# Altium schematic sheet main.SchDoc: Shield MCXC444
size A4; Author: Agustin Zuliani; CompanyName: Depto. de Sistemas e Informática (DSI); DrawnBy: Agustin Zuliani; Revision: Rev: 00; SheetNumber: 1; SheetTotal: 7
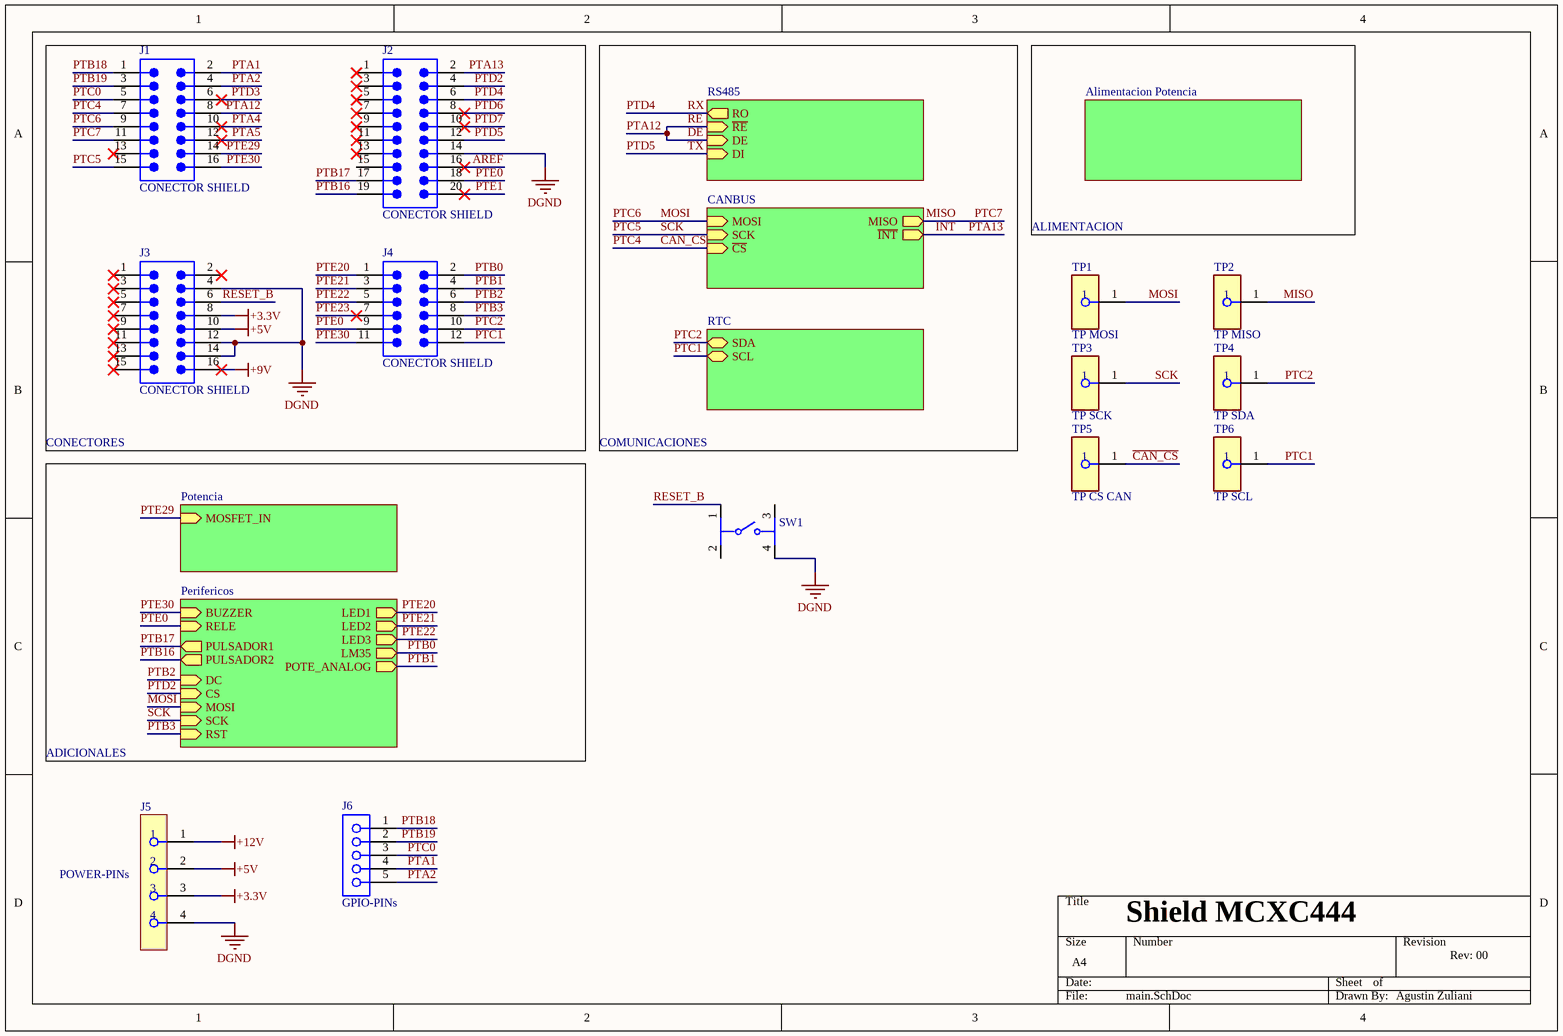
[diagram p0: main.SchDoc]

## Parts
J1  CONECTOR SHIELD  [61301621121]
J2  CONECTOR SHIELD  [61302021121]
J3  CONECTOR SHIELD  [61301621121]
J4  CONECTOR SHIELD  [61301221121]
J5  POWER-PINs  [FP-ESW-104-23-G-S-MFG]
J6  GPIO-PINs  [SMTC-SMH-105-02-X-S]
SW1  PULSADOR RESET  [FP-1-1825910-4-MFG]  (value not drawn)
TP1  TP MOSI  [FP-5004-MFG]
TP2  TP MISO  [FP-5004-MFG]
TP3  TP SCK  [FP-5004-MFG]
TP4  TP SDA  [FP-5004-MFG]
TP5  TP CS CAN  [FP-5004-MFG]
TP6  TP SCL  [FP-5004-MFG]

## Blocks framed on the sheet
CONECTORES: J1-J4

## Sub-sheets
Alimentacion Potencia = Alimentacion Potencia.SchDoc: no entries
CANBUS = CANBUS.SchDoc: MOSI (in), MISO (out), SCK (in), ~{CS} (in), ~{INT} (out)
Perifericos = Perifericos.SchDoc: LED1 (out), LED2 (out), LED3 (out), BUZZER (in), RELE (in), PULSADOR1 (out), PULSADOR2 (out), LM35 (out), POTE_ANALOG (out), DC (in), CS (in), MOSI (in), SCK (in), RST (in)
Potencia = Potencia.SchDoc: MOSFET_IN (in)
RS485 = RS485.SchDoc: ~{RE} (in), DE (in), DI (in), RO (out)
RTC = RTC.SchDoc: SDA (bidir), SCL (bidir)

## Nets
+3.3V: J3.8 J5.3
+5V: J3.10 J5.2
+9V: J3.16
+12V: J5.1
DGND: J2.14 J3.4 J3.12 J3.14 J5.4 SW1.4
~{CAN_CS}: J1.7 TP5.1 ; sheet CANBUS/~{CS}  [also labelled PTC4]
~{INT}: J2.2 ; sheet CANBUS/~{INT}  [also labelled PTA13]
~{RE}: J1.8 ; sheet RS485/~{RE}, sheet RS485/DE  [also labelled DE, PTA12]
AREF: J2.16
MISO: J1.11 TP2.1 ; sheet CANBUS/MISO  [also labelled PTC7]
MOSI: J1.9 TP1.1 ; sheet CANBUS/MOSI, sheet Perifericos/MOSI  [also labelled PTC6]
PTA1: J1.2 J6.4
PTA2: J1.4 J6.5
PTA4: J1.10
PTA5: J1.12
PTB0: J4.2 ; sheet Perifericos/LM35
PTB1: J4.4 ; sheet Perifericos/POTE_ANALOG
PTB2: J4.6 ; sheet Perifericos/DC
PTB3: J4.8 ; sheet Perifericos/RST
PTB16: J2.19 ; sheet Perifericos/PULSADOR2
PTB17: J2.17 ; sheet Perifericos/PULSADOR1
PTB18: J1.1 J6.1
PTB19: J1.3 J6.2
PTC0: J1.5 J6.3
PTC1: J4.12 TP6.1 ; sheet RTC/SCL
PTC2: J4.10 TP4.1 ; sheet RTC/SDA
PTC5: J1.15 TP3.1 ; sheet CANBUS/SCK, sheet Perifericos/SCK  [also labelled SCK]
PTD2: J2.4 ; sheet Perifericos/CS
PTD3: J1.6
PTD4: J2.6 ; sheet RS485/RO  [also labelled RX]
PTD5: J2.12 ; sheet RS485/DI  [also labelled TX]
PTD6: J2.8
PTD7: J2.10
PTE0: J2.18 J4.9 ; sheet Perifericos/RELE
PTE1: J2.20
PTE20: J4.1 ; sheet Perifericos/LED1
PTE21: J4.3 ; sheet Perifericos/LED2
PTE22: J4.5 ; sheet Perifericos/LED3
PTE23: J4.7
PTE29: J1.14 ; sheet Potencia/MOSFET_IN
PTE30: J1.16 J4.11 ; sheet Perifericos/BUZZER
RESET_B: J3.6 SW1.1

Not connected (* = marked no-connect by the designer): J1 13*; J2 1* 3* 5* 7* 9* 11* 13* 15; J3 1* 2* 3* 5* 7* 9* 11* 13* 15*; SW1 2 3

## Notes on the sheet
- ALIMENTACION
- COMUNICACIONES
- ADICIONALES

## Library data of the parts
J1 J3 = CMP-1502-01097-3: HEADER PINS 16 POS 2.54mm / Conexion shield; NexarPartId: 32855550; Contact Resistance: 20mΩ; Operating Supply Voltage: 250V; Number of Contacts: 16; Current Rating: 3A; Connector Type: Male Pin; Gender: Male; Min Operating Temperature: -40°C; Contact Material: Copper; RoHS: Compliant; Lead Pitch: 2.54mm; Color: Black; Contact Mating Length: 5.9944mm; REACH SVHC: Unknown; Number of Rows: 2; Orientation: Vertical; Number of Positions: 16; Max Operating Temperature: 105°C; Termination: Solder; Packaging: Bulk; Height: 8.89mm; Mount: Through Hole; Contact Plating: Gold; Row Spacing: 2.54mm; Voltage Rating: 250V; Number of Pins: 16; Pitch: 2.54mm
J2 = CMP-1502-01104-3: HEADER PINS 20 POS 2.54mm / Conexion shield; NexarPartId: 32855556; Current Rating: 3A; Operating Supply Voltage: 250V; Contact Resistance: 20mΩ; Gender: Male; Number of Positions: 20; Connector Type: Male Pin; Contact Material: Copper; Number of Rows: 2; Lead Pitch: 2.54mm; Packaging: Bulk; Mount: Through Hole; Number of Pins: 20; Row Spacing: 2.54mm; Contact Mating Length: 5.9944mm; Number of Contacts: 20; Pitch: 2.54mm; Color: Black; Contact Plating: Gold; Orientation: Vertical; Termination: Solder; REACH SVHC: Unknown; RoHS: Compliant
J4 = CMP-1502-01088-4: HEADER PINS 12 POS 2.54mm / Conexion shield; NexarPartId: 32855540; Gender: Male; Number of Contacts: 12; Contact Resistance: 20mΩ; Connector Type: Male Pin; Current Rating: 3A; Operating Supply Voltage: 250V; Termination: Solder; Contact Plating: Gold; Height: 8.89mm; Color: Black; Row Spacing: 2.54mm; Contact Mating Length: 5.9944mm; REACH SVHC: Unknown; Mount: Through Hole; Orientation: Vertical; Number of Rows: 2; Packaging: Bulk; Number of Pins: 12; Number of Positions: 12; Contact Material: Copper; Lead Pitch: 2.54mm; Min Operating Temperature: -40°C; Voltage Rating: 250V; RoHS: Compliant; Pitch: 2.54mm; Max Operating Temperature: 105°C
J5 = CMP-00575-09268283-1: HEADER PINS 4 POS 2.54mm / Power Pins; Manufacturer Lifecycle Status: PRODUCTION; Contact Resistance: 10mΩ; Max Voltage Rating (AC): 550V; Current Rating: 5.2A; Max Current Rating: 6.9A; Number of Contacts: 4; Length: 10.67mm; Termination: Solder; Contact Material: Gold, Nickel; Orientation: Straight; Housing Material: Polyester; Max Operating Temperature: 125°C; Depth: 2.41mm; RoHS: Compliant; Housing Color: Black; Min Operating Temperature: -55°C; Number of Rows: 1; Height: 13.72mm; Radiation Hardening: No; Lifecycle Status: Production; Pitch: 2.54mm; Contact Plating: Gold
J6 = CMP-1023-00168-1: HEADER PINS 5 POS / Gpios Pins; PartNumber: SMH-105-02-G-S; Manufacturer: Samtec; Pitch: 2.54 mm; ComponentLink2Description: Datasheet; RoHS: True; ComponentLink2URL: http://www.samtec.com/documents/webfiles/pdf/SMH.PDF; ComponentLink1URL: http://www.samtec.com; DatasheetVersion: F-214; PackageReference: SMH-105-02-X-S; ComponentLink3URL: http://www.samtec.com/documents/webfiles/cpdf/SMH-1XX-XX-XX-X-XX-MKT.pdf; PackageDescription: .100 [2.54] Horizontal SMT Socket Assembly; Mounting Technology: Surface Mount; PackageVersion: AF, 2/1999; ComponentLink3Description: Package Specification; Temperature Range: -55 to 125 degC; Orientation: Horizontal; ComponentLink1Description: Manufacturer URL
SW1 = CMP-03407-000002-1: SWITCH TACTILE 6mm / RESET; Manufacturer: TE Connectivity; Manufacturer Part Number: 1-1825910-4; Throw Configuration: SPST-NO; Operating Force: 160gf; Contact Current Rating: 50mA; Voltage Rating Dc: 24V; Electromechanical Life: 100000Cycles; Contact Resistance: 100mΩ; Octopart: https://octopart.com/1-1825910-4-te+connectivity-42270468; ComponentLink2URL: https://www.te.com/commerce/DocumentDelivery/DDEController?Action=showdoc&DocId=Customer+Drawing%7F1825910%7FC10%7Fpdf%7FEnglish%7FENG_CD_1825910_C10.pdf%7F1-1825910-4; Height: 9.8mm; Package: 1-1825910-4; Automotive: No; Device Class L2: Switches; Temperature Range High: +85°C; Device Class L3: Tactile Switches; Mouser Description: Tactile Switches 6MM ACTHIGH TEMP TACT SWITCH; Lead Free: Yes; Temperature Range Low: -35°C; Digikey Description: SWITCH TACTILE SPST-NO 0.05A 24V; Device Class L1: Electromechanical; Mount: Through Hole; RoHS: TRUE; ComponentLink2Description: Datasheet; Temperature: -35°C to +85°C; Category: Switch
TP1-TP6 = CMP-2000-05575-2: PC TEST POINT MINIATURE YELLOW; Manufacturer: Keystone; Manufacturer Part Number: 5004; Number Of Contacts: 1; Is Female: yes; Device Class L1: Connectors; Digikey Description: PC TEST POINT MINIATURE YELLOW; ComponentLink2URL: https://www.keyelco.com/product-pdf.cfm?p=1313; Lead Free: Yes; ComponentLink2Description: Datasheet; Category: Conn; Height: 4.72mm; Octopart: https://octopart.com/5004-keystone-28591; Mouser Description: TEST POINT PC MINI .040"D YELLOW; Device Class L3: unset; Contact Material: Silver; Package: 5004; Automotive: No; Device Class L2: unset; RoHS: TRUE